# EAGLE design circuito v2 (EAGLE 9.0.1)

## Sheet 1 of 2
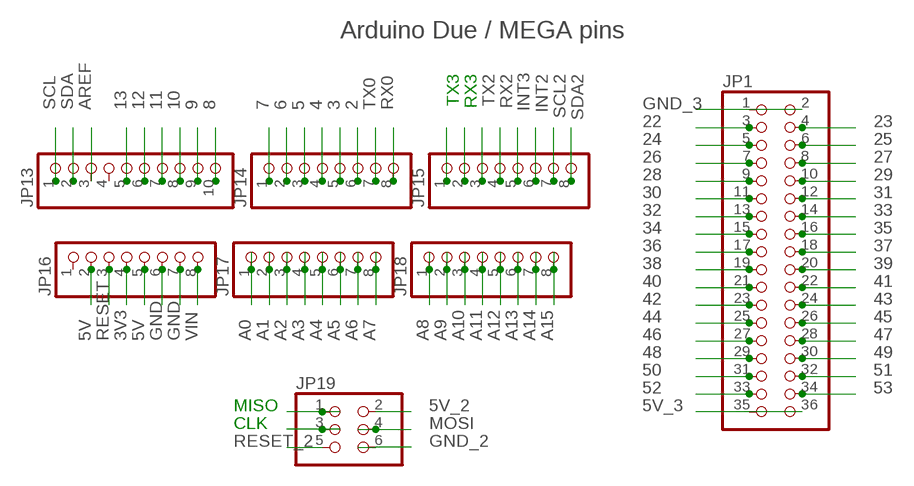
[diagram p0: schematic, sheet 1]

### Parts
JP1  PINHD-2X18  [2X18]
JP13  PINHD-1X10  [1X10]
JP14  PINHD-1X8  [1X08]
JP15  PINHD-1X8  [1X08]
JP16  PINHD-1X8  [1X08]
JP17  PINHD-1X8  [1X08]
JP18  PINHD-1X8  [1X08]
JP19  PINHD-2X3  [2X03]

### Nets
2: JP14.6
3: JP14.5
3V3: JP16.4
4: JP14.4
5: JP14.3
5V: JP16.2 JP16.5
5V_2: JP19.2
5V_3: JP1.36
6: JP14.2
7: JP14.1
8: JP13.10
9: JP13.9
10: JP13.8
11: JP13.7
12: JP13.6
13: JP13.5
22: JP1.3
23: JP1.4
24: JP1.5
25: JP1.6
26: JP1.7
27: JP1.8
28: JP1.9
29: JP1.10
30: JP1.11
31: JP1.12
32: JP1.13
33: JP1.14
34: JP1.15
35: JP1.16
36: JP1.17
37: JP1.18
38: JP1.19
39: JP1.20
40: JP1.21
41: JP1.22
42: JP1.23
43: JP1.24
44: JP1.25
45: JP1.26
46: JP1.27
47: JP1.28
48: JP1.29
49: JP1.30
50: JP1.31
51: JP1.32
52: JP1.33
53: JP1.34
A0: JP17.1
A1: JP17.2
A2: JP17.3
A3: JP17.4
A4: JP17.5
A5: JP17.6
A6: JP17.7
A7: JP17.8
A8: JP18.1
A9: JP18.2
A10: JP18.3
A11: JP18.4
A12: JP18.5
A13: JP18.6
A14: JP18.7
A15: JP18.8
AREF: JP13.3
CLK: JP19.3
GND: JP16.6 JP16.7 ; also sheet 2
GND_3: JP1.2
INT2: JP15.6
INT3: JP15.5
MISO: JP19.1
MOSI: JP19.4
RESET: JP16.3
RESET_2: JP19.5
RX0: JP14.8
RX2: JP15.4
RX3: JP15.2
SCL: JP13.1
SCL2: JP15.7
SDA: JP13.2
SDA2: JP15.8
TX0: JP14.7
TX2: JP15.3
TX3: JP15.1
VIN: JP16.8
Unconnected: JP1.1 JP1.35 JP13.4 JP16.1 JP19.6

### Notes on the sheet
- Arduino Due / MEGA pins

## Sheet 2 of 2
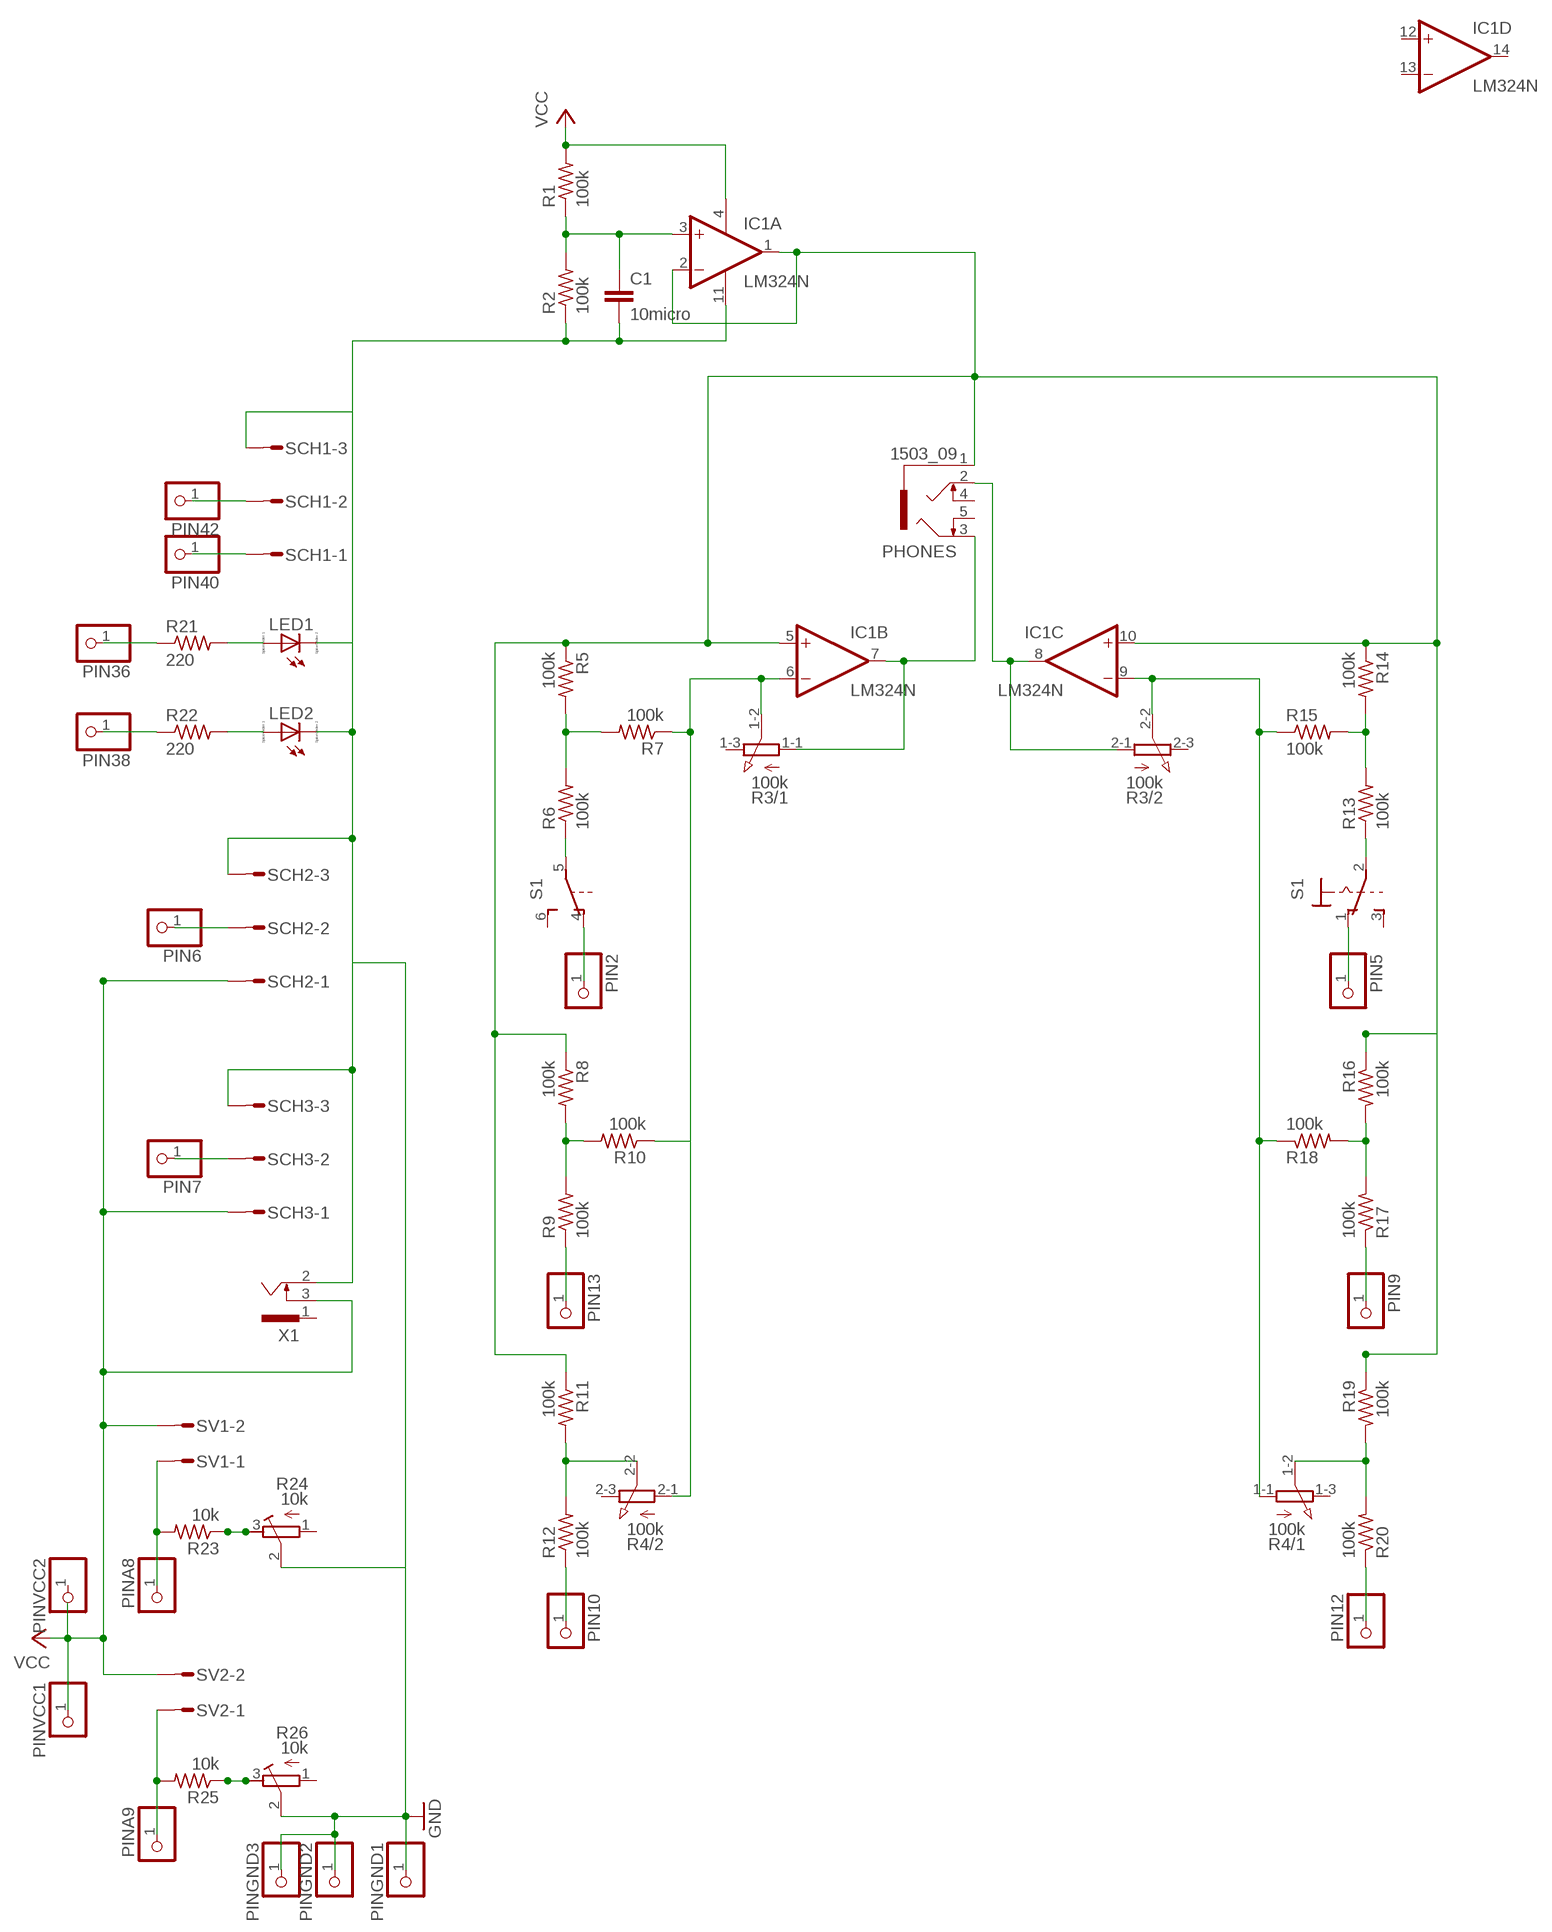
[diagram p1: schematic, sheet 2]

### Parts
C1  10micro  C-EU025-030X050  [C025-030X050]
IC1  LM324N  [DIL14]
LED1  LED_ELD260  [LED_LD260]
LED2  LED_ELD260  [LED_LD260]
PHONES  1503_09  [1503_09]
PIN2  PINHD-1X1  [1X01]
PIN5  PINHD-1X1  [1X01]
PIN6  PINHD-1X1  [1X01]
PIN7  PINHD-1X1  [1X01]
PIN9  PINHD-1X1  [1X01]
PIN10  PINHD-1X1  [1X01]
PIN12  PINHD-1X1  [1X01]
PIN13  PINHD-1X1  [1X01]
PIN36  PINHD-1X1  [1X01]
PIN38  PINHD-1X1  [1X01]
PIN40  PINHD-1X1  [1X01]
PIN42  PINHD-1X1  [1X01]
PINA8  PINHD-1X1  [1X01]
PINA9  PINHD-1X1  [1X01]
PINGND1  PINHD-1X1  [1X01]
PINGND2  PINHD-1X1  [1X01]
PINGND3  PINHD-1X1  [1X01]
PINVCC1  PINHD-1X1  [1X01]
PINVCC2  PINHD-1X1  [1X01]
R1  100k  R-US_0207/7  [0207/7]
R2  100k  R-US_0207/7  [0207/7]
R3  100k  3RP/1610G  [3RP/1610G]
R4  100k  3RP/1610G  [3RP/1610G]
R5  100k  R-US_0207/7  [0207/7]
R6  100k  R-US_0207/7  [0207/7]
R7  100k  R-US_0207/7  [0207/7]
R8  100k  R-US_0207/7  [0207/7]
R9  100k  R-US_0207/7  [0207/7]
R10  100k  R-US_0207/7  [0207/7]
R11  100k  R-US_0207/7  [0207/7]
R12  100k  R-US_0207/7  [0207/7]
R13  100k  R-US_0207/7  [0207/7]
R14  100k  R-US_0207/7  [0207/7]
R15  100k  R-US_0207/7  [0207/7]
R16  100k  R-US_0207/7  [0207/7]
R17  100k  R-US_0207/7  [0207/7]
R18  100k  R-US_0207/7  [0207/7]
R19  100k  R-US_0207/7  [0207/7]
R20  100k  R-US_0207/7  [0207/7]
R21  220  R-US_0207/7  [0207/7]
R22  220  R-US_0207/7  [0207/7]
R23  10k  R-US_0207/7  [0207/7]
R24  10k  R-TRIMM64W  [RTRIM64W]
R25  10k  R-US_0207/7  [0207/7]
R26  10k  R-TRIMM64W  [RTRIM64W]
S1  320-938  [320-938]
SCH1  L03P  [L03P]
SCH2  L03P  [L03P]
SCH3  L03P  [L03P]
SV1  L02P  [L02P]
SV2  L02P  [L02P]
X1  SCD-014A  [SCD-014-A]

### Nets
GND: PINGND1.1 PINGND2.1 PINGND3.1 R24.2(S) R26.2(S) ; also sheet 1
N$1: C1.1 IC1.3(A:+IN) R1.1 R2.2
N$2: IC1.1(A:OUT) IC1.2(A:-IN) IC1.5(B:+IN) IC1.10(C:+IN) PHONES.1 R5.1 R8.1 R11.1 R14.1 R16.1
N$3: PIN13.1 R9.1
N$4: IC1.6(B:-IN) R3.1-2(/1:S) R4.2-1(/2:A) R7.1
N$5: R5.2 R6.2 R7.2
N$6: R6.1 S1.5(B:P)
N$7: PIN2.1 S1.4(B:O)
N$8: R10.1
N$9: R8.2 R9.2 R10.2
N$11: R4.2-2(/2:S) R11.2 R12.2
N$12: PIN10.1 R12.1
N$13: IC1.9(C:-IN) R3.2-2(/2:S) R4.1-1(/1:A) R15.1 R18.1
N$14: R13.2 R14.2 R15.2
N$15: R13.1 S1.2(1:P)
N$16: PIN5.1 S1.1(1:O)
N$17: R19.1
N$18: R4.1-2(/1:S) R19.2 R20.2
N$19: R16.2 R17.2 R18.2
N$20: PIN9.1 R17.1
N$21: PIN12.1 R20.1
N$22: PIN42.1 SCH1.2
N$23: PIN40.1 SCH1.1
N$24: LED1.A R21.2
N$25: PIN36.1 R21.1
N$26: LED2.A R22.2
N$27: PIN38.1 R22.1
N$28: PIN7.1 SCH3.2
N$29: PIN6.1 SCH2.2
N$30: IC1.8(C:OUT) PHONES.2 R3.2-1(/2:A)
N$31: PINA8.1 R23.2 SV1.1
N$32: R23.1 R24.3(E)
N$33: SV2.2
N$34: PINA9.1 R25.2 SV2.1
N$35: R25.1 R26.3(E)
N$36: C1.2 IC1.11(P:V-) LED1.K(C) LED2.K(C) R2.1 SCH1.3 SCH2.3 SCH3.3 X1.2
N$37: IC1.7(B:OUT) PHONES.3 R3.1-1(/1:A)
VCC: IC1.4(P:V+) PINVCC1.1 R1.2 SCH2.1 SCH3.1 SV1.2 X1.3
Unconnected: IC1.12(D:+IN) IC1.13(D:-IN) IC1.14(D:OUT) PHONES.4 PHONES.5 PINVCC2.1 R3.1-3(/1:E) R3.2-3(/2:E) R4.1-3(/1:E) R4.2-3(/2:E) R24.1(A) R26.1(A) S1.3(1:S) S1.6(B:S) X1.1

## Library data of the parts
C1 = rcl:C-EU: CAPACITOR, European symbol; SPICEPREFIX: C
IC1 = linear:LM324: OP AMP
JP1 = pinhead:PINHD-2X18: PIN HEADER
JP13 = pinhead:PINHD-1X10: PIN HEADER
JP14-JP18 = pinhead:PINHD-1X8: PIN HEADER
JP19 = pinhead:PINHD-2X3: PIN HEADER
LED1 LED2 = eagle-ltspice:LED_E: LED Source: http://www.osram.convergy.de Source: www.luxeon.com Source: www.kingbright.com; SPICEMODEL: NONE; SPICEPREFIX: D; SPICETYPE: diode
PHONES = con-lumberg:1503_09: Jack connectors according to JISC 6560, 3.5 mm Klinkeneinbaukupplung nach JISC 6560, 3,5 mm, 3-polig/ stereo, abgewinkelte Ausführung, mit 2 Öffnern und Lötaugen, für Leiterplatten Rückseitenmontage Source: http://www.lumberg.com/Produkte/PDFs/1503_09.pdf; OC_FARNELL: 1243244; OC_NEWARK: unknown
PIN2 PIN5-PIN7 PIN9 PIN10 PIN12 PIN13 PIN36 PIN38 PIN40 PIN42 PINA8 PINA9 PINGND1-PINGND3 PINVCC1 PINVCC2 = pinhead:PINHD-1X1: PIN HEADER
R1 R2 R5-R23 R25 = rcl:R-US_: RESISTOR, American symbol; SPICEPREFIX: R
R3 R4 = pot:3RP/1610G: 16mm Potentiometer two level Source: http://www.alphapotentiometers.net/html/16mm_pot_2.html
R24 R26 = rcl:R-TRIMM: Trimm resistor; SPICEMODEL: X; SPICEPREFIXL: POT
S1 = switch:320-938: TOGGLE SWITCH distributor RS Components
SCH1-SCH3 = con-amp-mt:L03P: AMP MT CONNECTOR; OC_FARNELL: unknown; OC_NEWARK: unknown
SV1 SV2 = con-amp-mt:L02P: AMP MT CONNECTOR; OC_FARNELL: unknown; OC_NEWARK: unknown
X1 = con-shiua-chyuan:SCD-014A: Power Jack 2.5mm; OC_FARNELL: unknown; OC_NEWARK: unknown

## Net classes
1 vcc: width 0.305 mm

## Board
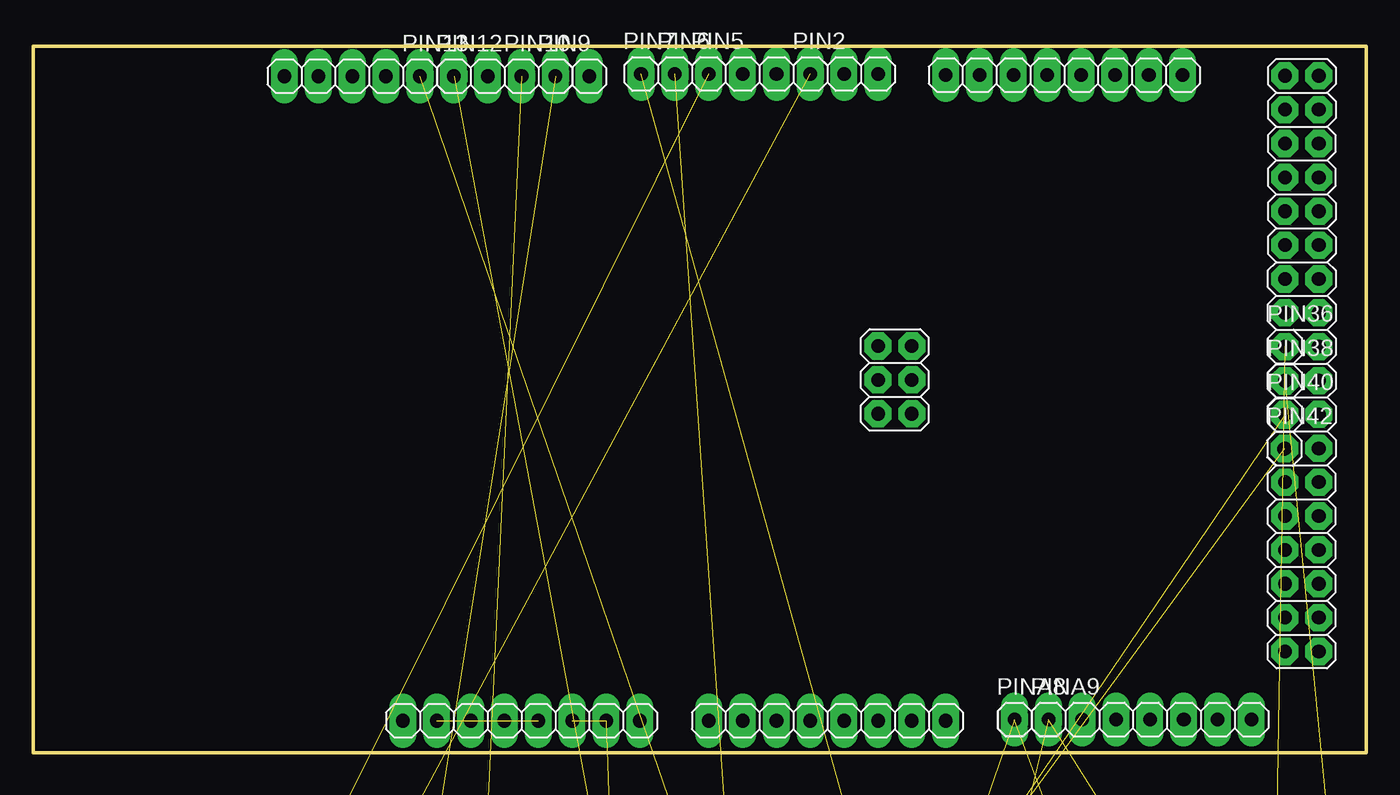
[diagram p2: board, top side]
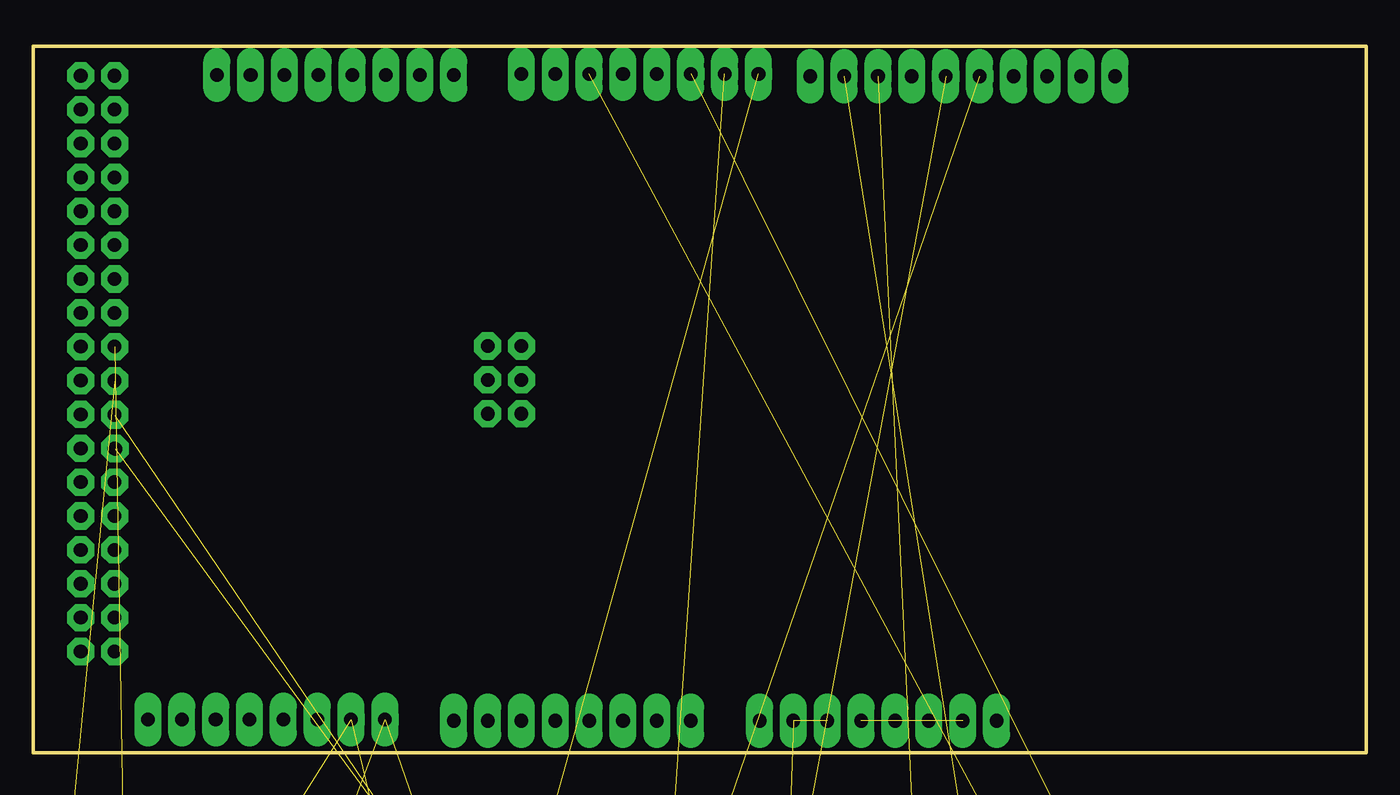
[diagram p3: board, bottom side, seen from below]

Size 100 x 53 mm. Coordinates in mm from the lower left corner, seen from the top.
Outline: 0,0 100,0 100,53 0,53 0,0
Copper layers (1*16): Top 0.035mm / dielectric 1.5mm / Bottom 0.035mm
Design rules "default *": minimum track width 20mil, minimum drill 24mil, track to track 15mil, track to pad 15mil, pad to pad 15mil, via to via 15mil, smd to smd 8mil, copper to edge 40mil, drill to drill 8mil, minimum pad ring 10mil, minimum via ring 8mil, stop-mask expansion 4mil, vias tented up to drill 0mil, thermal gap 10mil

### Footprints (pad centres in the part's own frame; a part is rotated, then mirrored left to right if it is on the bottom)
C025-030X050 = drill 0.813 octagon: 1 -1.27,0; 2 1.27,0
DIL14 = drill 0.813 long: 1 -7.62,-3.81; 2 -5.08,-3.81; 3 -2.54,-3.81; 4 0,-3.81; 5 2.54,-3.81; 6 5.08,-3.81; 7 7.62,-3.81; 8 7.62,3.81; 9 5.08,3.81; 10 2.54,3.81; 11 0,3.81; 12 -2.54,3.81; 13 -5.08,3.81; 14 -7.62,3.81
2X18 = drill 1.016 octagon: 1 -21.59,-1.27; 2 -21.59,1.27; 3 -19.05,-1.27; 4 -19.05,1.27; 5 -16.51,-1.27; 6 -16.51,1.27; 7 -13.97,-1.27; 8 -13.97,1.27; 9 -11.43,-1.27; 10 -11.43,1.27; 11 -8.89,-1.27; 12 -8.89,1.27; 13 -6.35,-1.27; 14 -6.35,1.27; 15 -3.81,-1.27; 16 -3.81,1.27; 17 -1.27,-1.27; 18 -1.27,1.27; 19 1.27,-1.27; 20 1.27,1.27; 21 3.81,-1.27; 22 3.81,1.27; 23 6.35,-1.27; 24 6.35,1.27; 25 8.89,-1.27; 26 8.89,1.27; 27 11.43,-1.27; 28 11.43,1.27; 29 13.97,-1.27; 30 13.97,1.27; 31 16.51,-1.27; 32 16.51,1.27; 33 19.05,-1.27; 34 19.05,1.27; 35 21.59,-1.27; 36 21.59,1.27
1X10 = drill 1.016 long: 1 -11.43,0; 2 -8.89,0; 3 -6.35,0; 4 -3.81,0; 5 -1.27,0; 6 1.27,0; 7 3.81,0; 8 6.35,0; 9 8.89,0; 10 11.43,0
1X08 = drill 1.016 long: 1 -8.89,0; 2 -6.35,0; 3 -3.81,0; 4 -1.27,0; 5 1.27,0; 6 3.81,0; 7 6.35,0; 8 8.89,0
2X03 = drill 1.016 octagon: 1 -2.54,-1.27; 2 -2.54,1.27; 3 0,-1.27; 4 0,1.27; 5 2.54,-1.27; 6 2.54,1.27
LED_LD260 = drill 0.813 octagon: A -1.27,0; K 1.27,0
1503_09 = drill 0.8 pad 1.2 long: 1 0,-2.1; 2 -4.55,-5.4; 3 5.05,-9.9; 4 -4,-13.1; 5 2.65,-8.5
1X01 = drill 1.016 octagon: 1 0,0
0207/7 = drill 0.813 octagon: 1 -3.81,0; 2 3.81,0
3RP/1610G = drill 1.2 pad 2.184: 1-1 -5,0; 1-2 0,0; 1-3 5,0; 2-1 -5,5; 2-2 0,5; 2-3 5,5
RTRIM64W = drill 0.61: 1 1.27,-2.54; 2 1.27,0; 3 1.27,2.54
320-938 = drill 2.007 octagon: 1 -2.388,4.013; 2 -2.388,0; 3 -2.388,-4.013; 4 2.388,4.013; 5 2.388,0; 6 2.388,-4.013
L03P = drill 1.016 long: 1 2.5,-6.25; 2 0,-6.25; 3 -2.5,-6.25
L02P = drill 1.016 long: 1 1.25,-6.25; 2 -1.25,-6.25
SCD-014-A = drill 1 pad 2 long: 1 -2.5,13.8; 2 -2.5,7.5; 3 2.5,10.8

### Placement (x,y rotation side)
C1  50,-168 0 top  (outside the outline)
IC1  14.25,-80.5 0 top  (outside the outline)
JP1  95.17,29.19 90 top
JP13  30.27,50.75 0 top
JP14  54.49,50.92 0 top
JP15  77.34,50.83 0 top
JP16  36.62,2.41 0 top
JP17  59.57,2.41 0 top
JP18  82.51,2.49 0 top
JP19  64.65,27.98 90 top
LED1  65.75,-168 0 top  (outside the outline)
LED2  81.5,-168 0 top  (outside the outline)
PHONES  110.25,-14.5 0 top  (outside the outline)
PIN2  58.3,50.92 0 top
PIN5  50.67,50.92 0 top
PIN6  48.13,50.92 0 top
PIN7  45.59,50.92 0 top
PIN9  39.17,50.75 0 top
PIN10  36.63,50.75 0 top
PIN12  31.55,50.75 0 top
PIN13  29,50.75 0 top
PIN36  93.9,30.47 0 top
PIN38  93.9,27.89 0 top
PIN40  93.9,25.34 0 top
PIN42  93.85,22.8 0 top
PINA8  73.62,2.5 0 top
PINA9  76.17,2.5 0 top
PINGND1  7.5,-114 0 top  (outside the outline)
PINGND2  22.75,-114 0 top  (outside the outline)
PINGND3  38,-114 0 top  (outside the outline)
PINVCC1  53.25,-114 0 top  (outside the outline)
PINVCC2  68.5,-114 0 top  (outside the outline)
R1  86.75,-113 0 top  (outside the outline)
R2  107.75,-113 0 top  (outside the outline)
R3  51,-21.25 0 top  (outside the outline)
R4  83,-21.25 0 top  (outside the outline)
R5  10.5,-128.25 0 top  (outside the outline)
R6  31.5,-128.25 0 top  (outside the outline)
R7  52.5,-128.25 0 top  (outside the outline)
R8  73.5,-128.25 0 top  (outside the outline)
R9  94.5,-128.25 0 top  (outside the outline)
R10  115.5,-128.25 0 top  (outside the outline)
R11  10.5,-141.5 0 top  (outside the outline)
R12  31.5,-141.5 0 top  (outside the outline)
R13  52.5,-141.5 0 top  (outside the outline)
R14  73.5,-141.5 0 top  (outside the outline)
R15  94.5,-141.5 0 top  (outside the outline)
R16  115.5,-141.5 0 top  (outside the outline)
R17  10.5,-154.75 0 top  (outside the outline)
R18  31.5,-154.75 0 top  (outside the outline)
R19  52.5,-154.75 0 top  (outside the outline)
R20  73.5,-154.75 0 top  (outside the outline)
R21  94.5,-154.75 0 top  (outside the outline)
R22  115.5,-154.75 0 top  (outside the outline)
R23  10.5,-168 0 top  (outside the outline)
R24  33,-78.25 0 top  (outside the outline)
R25  31.5,-168 0 top  (outside the outline)
R26  44.5,-78.25 0 top  (outside the outline)
S1  17.5,-24.5 0 top  (outside the outline)
SCH1  35.25,-51 0 top  (outside the outline)
SCH2  55.5,-51 0 top  (outside the outline)
SCH3  75.75,-51 0 top  (outside the outline)
SV1  94.75,-51 0 top  (outside the outline)
SV2  112.5,-51 0 top  (outside the outline)
X1  12.5,-67.5 0 top  (outside the outline)

### Tracks (layer width: path | path; a pad name or v marks a point on that pad's centre or on a via)
5V  (1 unrouted)
GND  (6 unrouted)
N$1  (3 unrouted)
N$2  (9 unrouted)
N$3  (1 unrouted)
N$4  (3 unrouted)
N$5  (2 unrouted)
N$6  (1 unrouted)
N$7  (1 unrouted)
N$9  (2 unrouted)
N$10
  pour Bottom: 2.62,0 2.62,0.15 2.63,0.15
N$11  (2 unrouted)
N$12  (1 unrouted)
N$13  (4 unrouted)
N$14  (2 unrouted)
N$15  (1 unrouted)
N$16  (1 unrouted)
N$18  (2 unrouted)
N$19  (2 unrouted)
N$20  (1 unrouted)
N$21  (1 unrouted)
N$22  (1 unrouted)
N$23  (1 unrouted)
N$24  (1 unrouted)
N$25  (1 unrouted)
N$26  (1 unrouted)
N$27  (1 unrouted)
N$28  (1 unrouted)
N$29  (1 unrouted)
N$30  (2 unrouted)
N$31  (2 unrouted)
N$32  (1 unrouted)
N$34  (2 unrouted)
N$35  (1 unrouted)
N$36  (8 unrouted)
N$37  (2 unrouted)
VCC  (6 unrouted)